# EAGLE design remote (EAGLE 7.1.0)
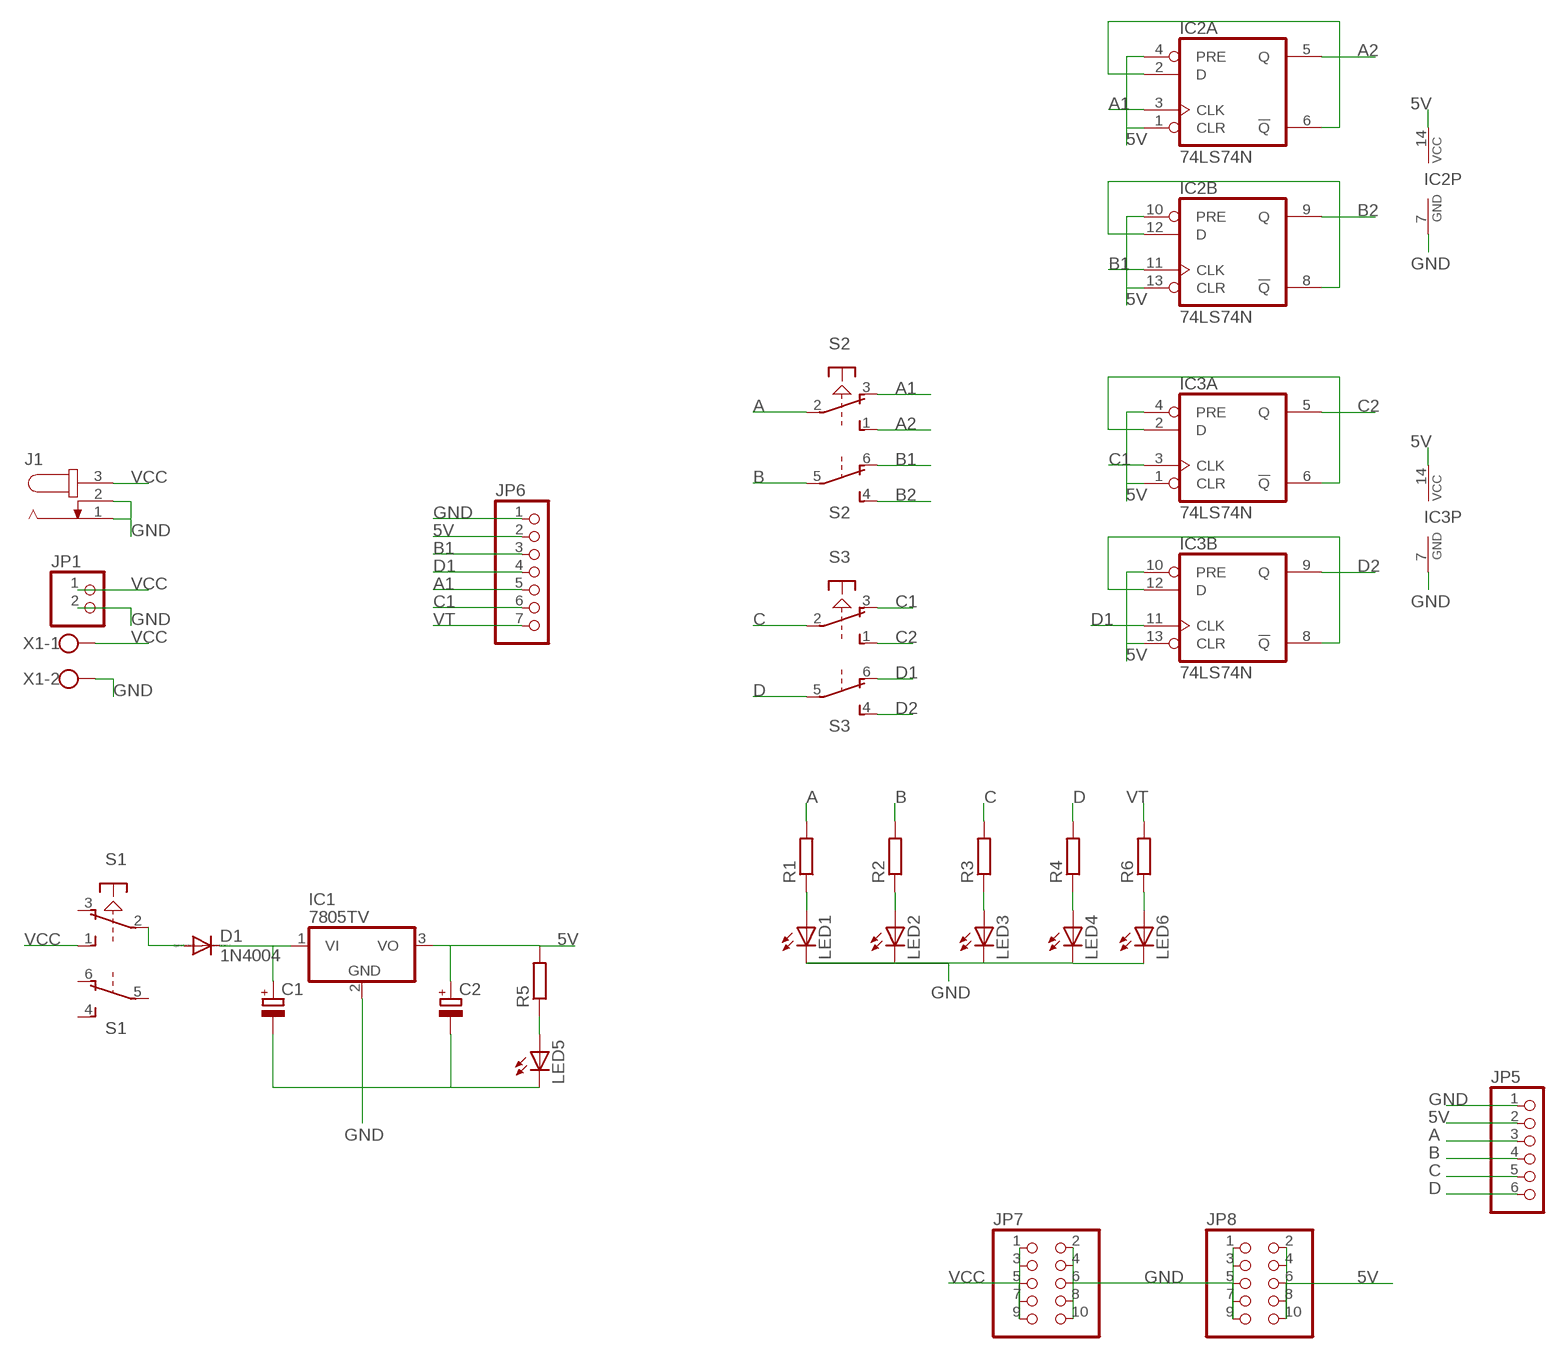
[diagram p0: schematic, sheet 1]

## Parts
C1  CPOL-EUE2.5-5  [E2,5-5]
C2  CPOL-EUE2.5-5  [E2,5-5]
D1  1N4004  [DO41-10]
IC1  7805TV  [TO220V]
IC2  74LS74N  [DIL14]
IC3  74LS74N  [DIL14]
J1  JACK-PLUG0  [SPC4077]
JP1  PINHD-1X2  [1X02]
JP5  PINHD-1X6  [1X06]
JP6  PINHD-1X7  [1X07]
JP7  PINHD-2X5  [2X05]
JP8  PINHD-2X5  [2X05]
LED1  LED3MM  [LED3MM]
LED2  LED3MM  [LED3MM]
LED3  LED3MM  [LED3MM]
LED4  LED3MM  [LED3MM]
LED5  LED3MM  [LED3MM]
LED6  LED3MM  [LED3MM]
R1  R-EU_0207/7  [0207/7]
R2  R-EU_0207/7  [0207/7]
R3  R-EU_0207/7  [0207/7]
R4  R-EU_0207/7  [0207/7]
R5  R-EU_0207/7  [0207/7]
R6  R-EU_0207/7  [0207/7]
S1  PVA2R  [PVA2R]
S2  PVA2R  [PVA2R]
S3  PVA2R  [PVA2R]
X1  W237-102  [W237-102]

## Nets
5V: C2.+ IC1.3(VO) IC2.1(A:CLR) IC2.4(A:PRE) IC2.10(B:PRE) IC2.13(B:CLR) IC2.14(P:VCC) IC3.1(A:CLR) IC3.4(A:PRE) IC3.10(B:PRE) IC3.13(B:CLR) IC3.14(P:VCC) JP5.2 JP6.2 JP8.2 JP8.4 JP8.6 JP8.8 JP8.10 R5.2
A: JP5.3 R1.2 S2.2(1:P)
A1: IC2.3(A:CLK) JP6.5 S2.3(1:O)
A2: IC2.5(A:Q) S2.1(1:S)
B: JP5.4 R2.2 S2.5(2:P)
B1: IC2.11(B:CLK) JP6.3 S2.6(2:O)
B2: IC2.9(B:Q) S2.4(2:S)
C: JP5.5 R3.2 S3.2(1:P)
C1: IC3.3(A:CLK) JP6.6 S3.3(1:O)
C2: IC3.5(A:Q) S3.1(1:S)
D: JP5.6 R4.2 S3.5(2:P)
D1: IC3.11(B:CLK) JP6.4 S3.6(2:O)
D2: IC3.9(B:Q) S3.4(2:S)
GND: C1.- C2.- IC1.2(GND) IC2.7(P:GND) IC3.7(P:GND) J1.1 J1.2 JP1.2 JP5.1 JP6.1 JP7.2 JP7.4 JP7.6 JP7.8 JP7.10 JP8.1 JP8.3 JP8.5 JP8.7 JP8.9 LED1.K(C) LED2.K(C) LED3.K(C) LED4.K(C) LED5.K(C) LED6.K(C) X1.2
N$1: D1.A S1.2(1:P)
N$2: C1.+ D1.C IC1.1(VI)
N$3: LED1.A R1.1
N$4: LED5.A R5.1
N$5: LED2.A R2.1
N$6: LED3.A R3.1
N$7: LED4.A R4.1
N$8: IC3.8(B:!Q) IC3.12(B:D)
N$10: LED6.A R6.1
N$16: IC3.2(A:D) IC3.6(A:!Q)
N$19: IC2.8(B:!Q) IC2.12(B:D)
N$22: IC2.2(A:D) IC2.6(A:!Q)
VCC: J1.3 JP1.1 JP7.1 JP7.3 JP7.5 JP7.7 JP7.9 S1.1(1:S) X1.1
VT: JP6.7 R6.2
Unconnected: S1.3(1:O) S1.4(2:S) S1.5(2:P) S1.6(2:O)

## Library data of the parts
C1 C2 = rcl:CPOL-EU: POLARIZED CAPACITOR, European symbol
D1 = diode:1N4004: DIODE general purpose rectifier, 1 A
IC1 = linear:78*: Positive VOLTAGE REGULATOR Source: http://cache.national.com/ds/LM/LM78L05.pdf http://www.fairchildsemi.com/ds/LM/LM7805.pdf
IC2 IC3 = 74xx-eu:74*74: Dual D type positive edge triggered FLIP FLOP, preset and clear
J1 = con-jack:JACK-PLUG: DC POWER JACK Power Jack, DC, Right Angle, Through Hole, Rated 5A at 16VDC, PC Terminals Distributor: Farnell (www.Farnell.de) Drawing: 84N1161.pdf / 84N1162.pdf Manufacturer: SPC Technology (www.spctechnology.com) Type: SPC4077 / SPC 4078; OC_FARNELL: unknown; OC_NEWARK: unknown
JP1 = pinhead:PINHD-1X2: PIN HEADER
JP5 = pinhead:PINHD-1X6: PIN HEADER
JP6 = pinhead:PINHD-1X7: PIN HEADER
JP7 JP8 = pinhead:PINHD-2X5: PIN HEADER
LED1-LED6 = led:LED: LED OSRAM: - CHIPLED LG R971, LG N971, LY N971, LG Q971, LY Q971, LO R971, LY R971 LH N974, LH R974 LS Q976, LO Q976, LY Q976 LO Q996 - Hyper CHIPLED LW Q18S LB Q993, LB Q99A, LB R99A - SideLED LS A670, LO A670, LY A670, LG A670, LP A670 LB A673, LV A673, LT A673, LW A673 LH A674 LY A675 LS A676, LA A676, LO A676, LY A676, LW A676 LS A679, LY A679, LG A679 - Hyper Micro SIDELED® LS Y876, LA Y876, LO Y876, LY Y876 LT Y87S - SmartLED LW L88C, LW L88S LB L89C, LB L89S, LG L890 LS L89K, LO L89K, LY L89K LS L896, LA L896, LO L896, LY L896 - TOPLED LS T670, LO T670, LY T670, LG T670, LP T670 LSG T670, LSP T670, LSY T670, LOP T670, LYG T670 LG T671, LOG T671, LSG T671 LB T673, LV T673, LT T673, LW T673 LH T674 LS T676, LA T676, LO T676, LY T676, LB T676, LH T676, LSB T676, LW T676 LB T67C, LV T67C, LT T67C, LS T67K, LO T67K, LY T67K, LW E67C LS E67B, LA E67B, LO E67B, LY E67B, LB E67C, LV E67C, LT E67C LW T67C LS T679, LY T679, LG T679 LS T770, LO T770, LY T770, LG T770, LP T770 LB T773, LV T773, LT T773, LW T773 LH T774 LS E675, LA E675, LY E675, LS T675 LS T776, LA T776, LO T776, LY T776, LB T776 LHGB T686 LT T68C, LB T68C - Hyper Mini TOPLED® LB M676 - Mini TOPLED Santana® LG M470 LS M47K, LO M47K, LY M47K Source: http://www.osram.convergy.de LUXEON: - LUMILED® LXK2-PW12-R00, LXK2-PW12-S00, LXK2-PW14-U00, LXK2-PW14-V00 LXK2-PM12-R00, LXK2-PM12-S00, LXK2-PM14-U00 LXK2-PE12-Q00, LXK2-PE12-R00, LXK2-PE12-S00, LXK2-PE14-T00, LXK2-PE14-U00 LXK2-PB12-K00, LXK2-PB12-L00, LXK2-PB12-M00, LXK2-PB14-N00, LXK2-PB14-P00, LXK2-PB14-Q00 LXK2-PR12-L00, LXK2-PR12-M00, LXK2-PR14-Q00, LXK2-PR14-R00 LXK2-PD12-Q00, LXK2-PD12-R00, LXK2-PD12-S00 LXK2-PH12-R00, LXK2-PH12-S00 LXK2-PL12-P00, LXK2-PL12-Q00, LXK2-PL12-R00 Source: www.luxeon.com KINGBRIGHT: KA-3528ASYC Source: www.kingbright.com
R1-R6 = rcl:R-EU_: RESISTOR, European symbol
S1-S3 = switch-misc:PVA2R: ITT SWITCH
X1 = con-wago-500:W237-102: WAGO SCREW CLAMP; MPN: 237-102; OC_FARNELL: unknown; OC_NEWARK: 70K9898

## Board
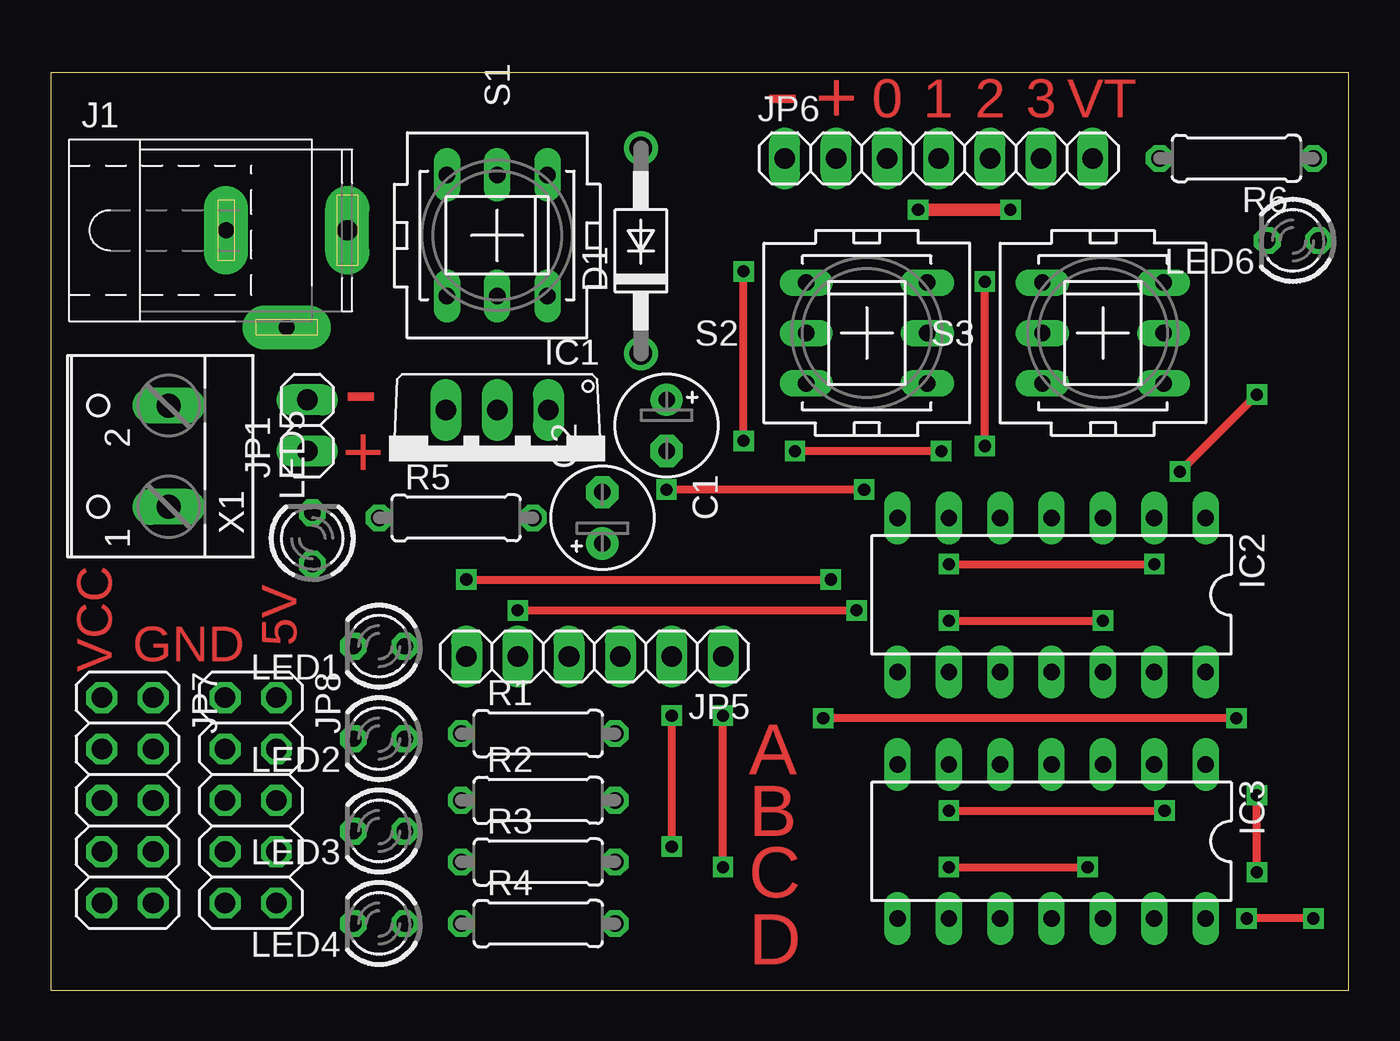
[diagram p1: board, top side]
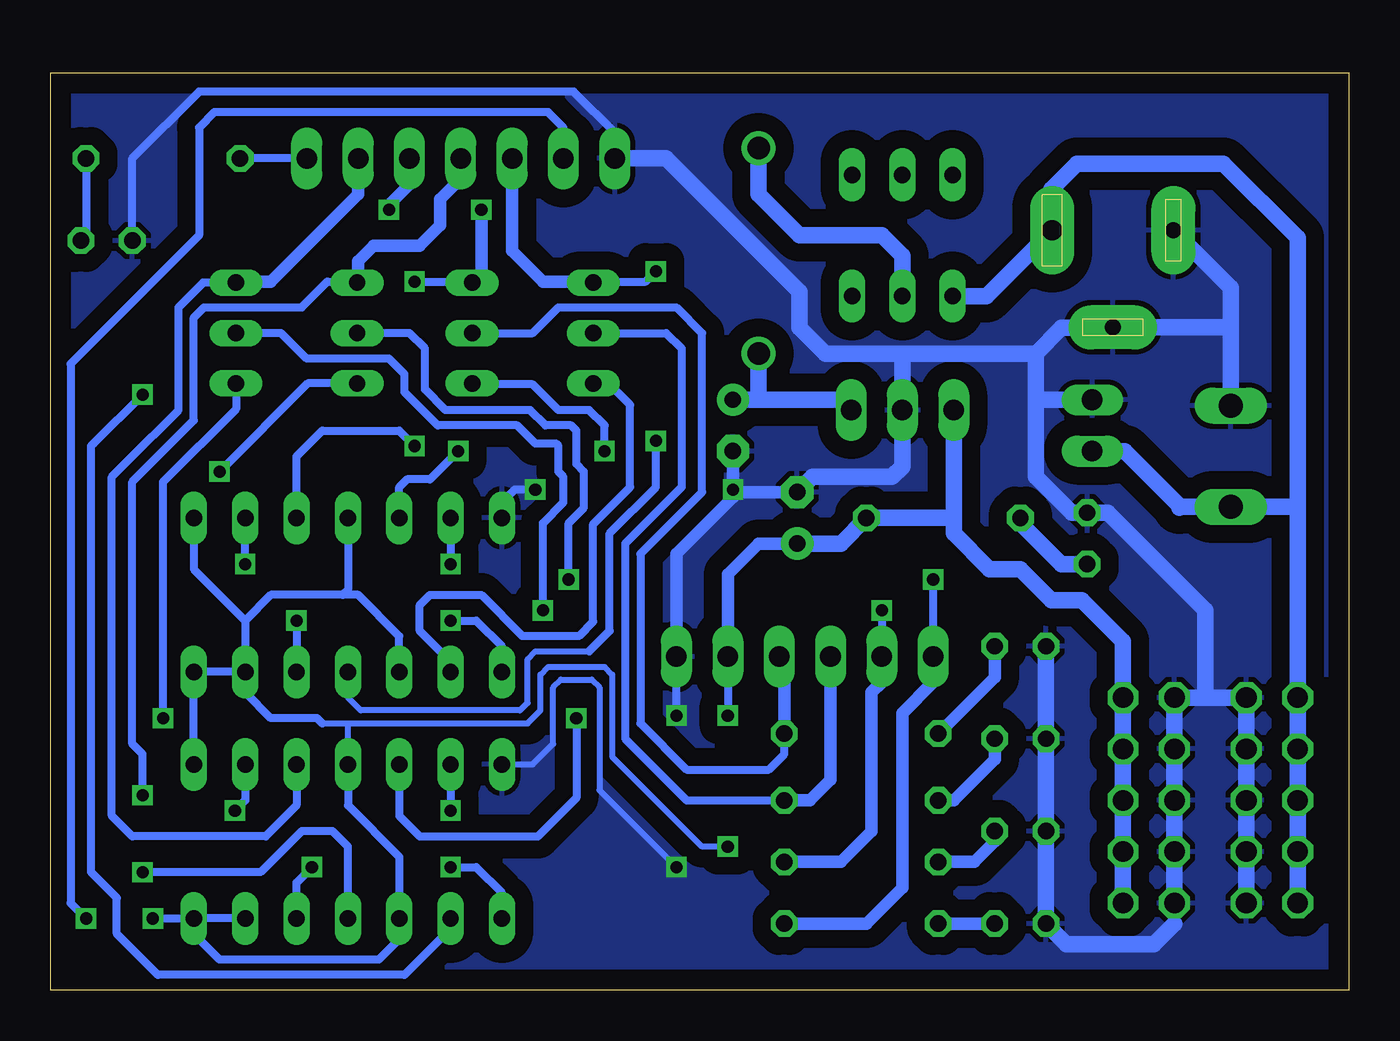
[diagram p2: board, bottom side, seen from below]

Size 64.24 x 45.39 mm. Coordinates in mm from the lower left corner, seen from the top.
Outline: 0,0 64.24,0 64.24,45.39 0,45.39 0,0
Copper layers (1*16): Top 0.035mm / dielectric 1.5mm / Bottom 0.035mm
Design rules "default *": minimum track width 10mil, minimum drill 24mil, track to track 35mil, track to pad 35mil, pad to pad 8mil, via to via 8mil, smd to smd 8mil, copper to edge 40mil, drill to drill 8mil, minimum pad ring 10mil, minimum via ring 8mil, stop-mask expansion 4mil, vias tented up to drill 0mil, thermal gap 10mil

### Footprints (pad centres in the part's own frame; a part is rotated, then mirrored left to right if it is on the bottom)
E2,5-5 = drill 0.813 pad 1.6: + -1.27,0 | drill 0.813 pad 1.6 octagon: - 1.27,0
DO41-10 = drill 1.118: A 5.08,0; C -5.08,0
TO220V = drill 1.016 long: 1 -2.54,-2.54; 2 0,-2.54; 3 2.54,-2.54
DIL14 = drill 0.813 long: 1 -7.62,-3.81; 2 -5.08,-3.81; 3 -2.54,-3.81; 4 0,-3.81; 5 2.54,-3.81; 6 5.08,-3.81; 7 7.62,-3.81; 8 7.62,3.81; 9 5.08,3.81; 10 2.54,3.81; 11 0,3.81; 12 -2.54,3.81; 13 -5.08,3.81; 14 -7.62,3.81
SPC4077 = drill 0.8 pad 2.184 long: 1 -3,0; 2 0,-4.8 | drill 1 pad 2.184 long: 3 3,0
1X02 = drill 1.016 long: 1 -1.27,0; 2 1.27,0
1X06 = drill 1.016 long: 1 -6.35,0; 2 -3.81,0; 3 -1.27,0; 4 1.27,0; 5 3.81,0; 6 6.35,0
1X07 = drill 1.016 long: 1 -7.62,0; 2 -5.08,0; 3 -2.54,0; 4 0,0; 5 2.54,0; 6 5.08,0; 7 7.62,0
2X05 = drill 1.016 octagon: 1 -5.08,-1.27; 2 -5.08,1.27; 3 -2.54,-1.27; 4 -2.54,1.27; 5 0,-1.27; 6 0,1.27; 7 2.54,-1.27; 8 2.54,1.27; 9 5.08,-1.27; 10 5.08,1.27
LED3MM = drill 0.813 octagon: A -1.27,0; K 1.27,0
0207/7 = drill 0.813 octagon: 1 -3.81,0; 2 3.81,0
PVA2R = drill 0.813 long: 1 -2.997,2.489; 2 -2.997,0; 3 -2.997,-2.489; 4 2.997,2.489; 5 2.997,0; 6 2.997,-2.489
W237-102 = drill 1.194 long: 1 -2.5,-1.27; 2 2.5,-1.27

### Placement (x,y rotation side)
C1  30.48,27.94 270 top
C2  27.31,23.37 90 top
D1  29.21,36.58 90 top
IC1  22.1,26.16 180 top
IC2  49.53,19.56 180 top
IC3  49.53,7.37 180 top
J1  11.68,37.59 0 top
JP1  12.7,27.94 90 top
JP5  26.92,16.51 180 top
JP6  43.94,41.15 0 top
JP7  3.81,9.4 270 top
JP8  9.91,9.4 270 top
LED1  16.26,17.02 180 top
LED2  16.26,12.45 180 top
LED3  16.26,7.87 180 top
LED4  16.26,3.3 180 top
LED5  12.95,22.35 90 top
LED6  61.47,37.08 180 top
R1  24.13,12.7 0 top
R2  24.13,9.4 0 top
R3  24.13,6.35 0 top
R4  24.13,3.3 0 top
R5  20.07,23.37 0 top
R6  58.67,41.15 180 top
S1  22.1,37.34 90 top
S2  40.39,32.51 180 top
S3  52.07,32.51 180 top
X1  4.57,26.42 90 top

### Tracks (layer width: path | path; a pad name or v marks a point on that pad's centre or on a via)
5V  (via drill 0.6)
  Top 0.406: v30.73,13.59 v30.73,7.11 | v62.48,3.56 v59.18,3.56
  Bottom 0.305: IC3.4 49.53,13.21 | 50.8,13.21 49.53,13.21 | 49.53,13.21 40.64,13.21 40,13.84 40,15.62 39.62,16 36.83,16 36.45,15.62 36.45,11.56 32,7.11 v30.73,7.11
  Bottom 0.406: IC3.14 57.15,2.79 55.88,1.52 48.01,1.52 46.99,2.54 IC3.10 46.99,6.6 49.53,9.14 IC3.4 | IC3.13 IC3.14 | IC2.13 IC2.14 IC3.1 | IC2.13 54.61,14.73 53.34,13.46 51.05,13.46 50.8,13.21 | IC2.10 46.99,17.53 49.02,19.56 49.78,19.56 | 49.78,19.56 53.34,19.56 54.61,18.29 | 54.61,18.29 IC2.13 | IC2.4 49.53,19.81 49.78,19.56 | IC2.1 57.15,20.83 54.61,18.29 | JP5.2 v30.73,13.59 | JP6.2 38.86,42.67 39.62,43.43 56.13,43.43 56.9,42.67 56.9,37.34 63.25,30.99 63.25,4.32 v62.48,3.56 | v59.18,3.56 IC3.14
  Bottom 0.61: JP5.2 30.73,20.57 29.21,22.1 C2.+
  Bottom 0.813: JP8.10 JP8.8 JP8.6 JP8.4 JP8.2 11.18,17.27 13.21,19.3 14.73,19.3 16.26,20.83 17.78,20.83 19.56,22.61 19.56,23.37 | IC1.3 19.56,23.37 | 19.56,23.37 R5.2 25.15,22.1 C2.+
A
  Bottom 0.406: S2.2 40.39,32.51 39.12,33.78 33.27,33.78 32,32.51 32,24.64 35.05,21.59 35.05,13.21 32.77,10.92 28.7,10.92 27.94,11.68 R1.2
  Bottom 0.61: R1.2 27.94,15.24 28.19,15.49 JP5.3
A1  (via drill 0.6)
  Top 0.406: v46.23,26.92 v46.23,35.05
  Top 0.61: v42.93,38.61 v47.5,38.61
  Bottom 0.406: S2.3 43.43,35.05 v46.23,35.05 | IC2.3 52.07,26.42 50.8,27.69 46.99,27.69 v46.23,26.92
  Bottom 0.61: v47.5,38.61 47.5,38.86 46.48,39.88 JP6.5 | v42.93,38.61 42.93,35.46 S2.3
A2  (via drill 0.6)
  Top 0.406: v44.07,26.67 v36.83,26.67
  Bottom 0.406: IC2.5 46.99,24.89 46.61,25.27 45.47,25.27 v44.07,26.67 | v36.83,26.67 36.83,27.94 37.59,28.7 39.12,28.7 40.39,29.97 43.33,29.97 S2.1
B
  Bottom 0.406: S2.5 33.78,32.51 33.02,31.75 33.02,24.89 35.81,22.1 35.81,12.45 32.77,9.4 R2.2
  Bottom 0.61: JP5.4 25.65,10.41 26.67,9.4 R2.2
B1  (via drill 0.6)
  Top 0.406: v34.29,27.18 v34.29,35.56
  Bottom 0.305: IC2.11 49.53,14.48 48.89,13.84 41.02,13.84 40.64,14.22 40.64,16.38 40.26,16.76 37.59,16.76
  Bottom 0.406: S2.6 37.34,35.05 34.8,35.05 v34.29,35.56 | v34.29,27.18 34.29,24.89 36.58,22.61 36.58,17.78 37.59,16.76
  Bottom 0.61: JP6.3 41.4,36.58 39.88,35.05 37.44,35.05 S2.6
B2
  Bottom 0.406: IC2.9 44.45,16.26 45.97,17.78 45.97,19.05 45.47,19.56 42.93,19.56 40.89,17.53 38.1,17.53 37.39,18.24 37.39,23.06 35.56,24.89 35.56,28.96 36.63,30.02 S2.4
C  (via drill 0.6)
  Top 0.406: v23.11,18.8 v39.88,18.8
  Bottom 0.406: S3.2 52.83,32.51 51.56,31.24 47.5,31.24 46.74,30.48 46.74,29.59 45.08,27.94 41.15,27.94 40.26,27.05 39.24,27.05 39.12,26.92 39.12,25.65 38.86,25.4 38.86,24.13 39.88,23.11 v39.88,18.8 | v23.11,18.8 JP5.5
  Bottom 0.61: JP5.5 23.11,15.24 23.62,14.73 23.62,7.87 25.15,6.35 R3.2
C1
  Bottom 0.406: IC3.3 52.07,9.14 53.59,7.62 60.2,7.62 61.21,8.64 61.21,25.4 60.96,25.65 60.45,26.16 57.91,28.7 57.91,33.78 56.69,35 S3.3
  Bottom 0.61: JP6.6 49.02,39.37 53.34,35.05 55.02,35.05 S3.3
C2  (via drill 0.6)
  Top 0.406: v58.67,13.46 v38.23,13.46
  Bottom 0.406: IC3.5 46.99,8.64 45.97,7.62 40.13,7.62 38.23,9.52 v38.23,13.46 | v58.67,13.46 58.67,25.15 55.07,28.75 S3.1
D  (via drill 0.6)
  Top 0.406: v20.57,20.32 v38.61,20.32
  Bottom 0.406: S3.5 46.48,32.51 45.72,31.75 45.72,29.72 44.7,28.7 40.51,28.7 39.75,27.94 38.48,27.94 38.23,27.69 38.23,26.04 37.85,25.65 37.85,23.88 38.61,23.11 v38.61,20.32 | v20.57,20.32 JP5.6
  Bottom 0.61: R4.2 23.88,3.3 22.1,5.08 22.1,13.72 20.57,15.24 JP5.6
D1  (via drill 0.6)
  Top 0.406: v59.69,5.84 v59.69,9.65
  Bottom 0.406: IC3.11 49.53,7.11 50.29,7.87 51.82,7.87 53.85,5.84 v59.69,5.84 | v59.69,9.65 59.69,11.68 60.2,12.19 60.2,25.15 57.15,28.19 57.15,33.27 56.64,33.78 51.82,33.78 50.55,35.05 49.12,35.05 S3.6
  Bottom 0.61: S3.6 49.02,35.05 49.02,36.07 48.26,36.83 45.97,36.83 44.96,37.85 44.96,39.12 43.94,40.13 JP6.4
D2  (via drill 0.6)
  Top 0.406: v55.88,25.65 v59.69,29.46
  Bottom 0.406: IC3.9 44.45,3.05 46.74,0.76 58.93,0.76 60.96,2.79 60.96,4.57 62.23,5.84 62.23,26.92 62.1,27.05 v59.69,29.46 | S3.4 51.51,30.02 v55.88,25.65
GND  (via drill 0.6)
  Top 0.406: v33.27,6.1 v33.27,13.59 | v40.26,24.76 v30.48,24.76
  Bottom 0.305: IC3.7 40.39,11.18 39.37,12.19 39.37,14.99 38.99,15.37 37.47,15.37 37.08,14.99 37.08,9.91 v33.27,6.1
  Bottom 0.406: v33.27,13.59 JP5.1 | v30.48,24.76 30.61,24.76 30.48,24.64 | LED6.K 60.2,41.15 56.9,44.45 38.35,44.45 36.32,42.42 JP6.1 | v40.26,24.76 41.28,24.76 41.91,24.13 IC2.7
  Bottom 0.61: JP5.1 33.27,21.59 30.48,24.38 30.48,24.64 | C1.- 30.48,24.64 | C2.- 30.48,24.64
  Bottom 0.813: X1.2 5.84,32.77 | 5.84,32.77 5.84,34.75 J1.1 | 5.84,32.77 5.87,32.79 J1.2 11.71,32.77 13.46,32.77 | 13.21,32.51 13.46,32.77 | 22.1,31.5 IC1.2 22.1,25.91 22.61,25.4 26.54,25.4 C2.- | 15.49,29.21 15.49,31.5 | 22.1,31.5 25.91,31.5 27.18,32.77 27.18,34.54 33.78,41.15 JP6.1 | 22.1,31.5 15.49,31.5 | 13.46,32.77 14.22,32.77 15.49,31.5 | JP7.10 JP7.8 JP7.6 JP7.4 JP7.2 7.11,14.48 | JP8.9 JP8.7 JP8.5 JP8.3 JP8.1 7.11,14.48 | JP1.2 15.49,29.21 | 15.49,29.21 15.49,25.4 13.72,23.62 LED5.K 11.94,23.62 7.11,18.8 7.11,14.48 | 8.64,3.3 9.65,2.29 13.97,2.29 LED4.K LED3.K LED2.K LED1.K
  pour Bottom: 0,45.47 64.26,45.47 64.26,0 0,0
N$1
  Bottom 0.813: S1.2 22.1,36.32 23.11,37.34 27.18,37.34 29.21,39.37 D1.A
N$2
  Bottom 0.813: C1.+ 29.21,29.21 | 29.21,29.21 25.15,29.21 IC1.1 | D1.C 29.21,29.21
N$3
  Bottom 0.61: LED1.A 17.53,15.49 R1.1
N$4
  Bottom 0.813: LED5.A 14.22,21.08 16.26,23.11 R5.1
N$5
  Bottom 0.61: LED2.A 17.53,11.43 19.56,9.4 R2.1
N$6
  Bottom 0.61: LED3.A 17.53,7.37 18.54,6.35 R3.1
N$7
  Bottom 0.61: LED4.A R4.1
N$8  (via drill 0.6)
  Top 0.406: v44.45,6.1 v51.31,6.1
  Bottom 0.406: IC3.8 41.91,4.83 43.18,6.1 v44.45,6.1 | IC3.12 52.07,5.33 v51.31,6.1
N$10
  Bottom 0.406: R6.1 62.48,37.34 LED6.A
N$16  (via drill 0.6)
  Top 0.406: v44.45,8.89 v55.12,8.89
  Bottom 0.406: IC3.6 v44.45,8.89 | IC3.2 54.61,9.4 v55.12,8.89
N$19  (via drill 0.6)
  Top 0.406: v44.45,18.29 v52.07,18.29
  Bottom 0.406: v52.07,18.29 IC2.12 | IC2.8 41.91,17.02 43.18,18.29 v44.45,18.29
N$22  (via drill 0.6)
  Top 0.406: v44.45,21.08 v54.61,21.08
  Bottom 0.406: IC2.6 v44.45,21.08 | v54.61,21.08 IC2.2
VCC
  Bottom 0.813: S1.1 17.94,34.34 J1.3 14.73,37.64 14.73,39.62 13.46,40.89 6.22,40.89 2.54,37.21 2.54,23.75 | JP7.9 JP7.7 JP7.5 JP7.3 JP7.1 2.54,23.75 | 8.34,23.92 8.38,23.88 | JP1.1 11.1,26.67 8.34,23.92 | 2.54,23.75 2.71,23.92 X1.1 8.34,23.92
VT
  Bottom 0.406: JP6.7 R6.2

### Text on the board
Top: - | + | 0 | 1 | 2 | 3 | VT | - | + | 5V | VCC | GND | A | B | C | D